# Altium schematic sheet PZ254V-12-8P1_PZ254V-12-8P.schdoc
size 127 x 99 mm
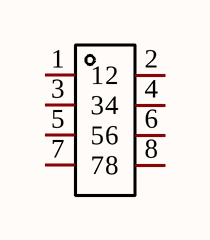
[diagram p0: PZ254V-12-8P1_PZ254V-12-8P.schdoc]

## Parts
H?  PZ254V-12-8P  [HDR-TH_8P-P2.54-V-M-R2-C4-S2.54]  (value not drawn)

## Nets

Not connected (* = marked no-connect by the designer): H? 1 2 3 4 5 6 7 8

## Library data of the parts
H? = PZ254V-12-8P: Manufacturer: XFCN(兴飞); Add into BOM: yes; Pin Structure: 2x4P; Pitch: 2.54mm; Circluar Pins/Square Pins: 方针; Symbol: PZ254V-12-8P; Device: PZ254V-12-8P; LCSC Part Name: 间距:2.54mm 2x4P 直插 方针; Supplier Part: C492421; Manufacturer Part: PZ254V-12-8P; Supplier Footprint: 插件,P=2.54mm; JLCPCB Part Class: Extended Part; Datasheet: https://atta.szlcsc.com/upload/public/pdf/source/20200309/C492421_DC8A206AF99CD7755BD4A5B0BC48200B.pdf; Supplier: LCSC; Convert to PCB: yes; Row Spacing: 2.54mm; Mounting Type: 直插; Number of Rows: 双排; Number of Pins: 8P; Current Rating (Max): -; Voltage Rating (Max): -; Length of Mating Pin: 6mm; Insulation Height: 2.5mm; Length of End Connection Pin: 3mm; Contact Material: 黄铜; Contact Plating: -; Operating Temperature Range: -40℃~+105℃; Color: 黑色